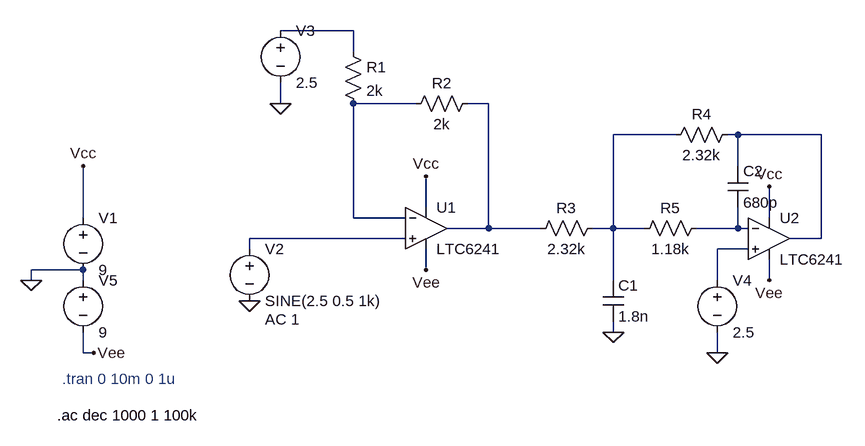
[diagram p0: schematic 60khz bessel lpf.asc]
60khz bessel lpf.asc, the LTspice schematic file:
Version 4
SHEET 1 880 680
WIRE 112 -128 0 -128
WIRE 112 -96 112 -128
WIRE 0 -16 0 -48
WIRE 208 -16 112 -16
WIRE 320 -16 288 -16
WIRE 608 32 512 32
WIRE 704 32 688 32
WIRE 832 32 704 32
WIRE 704 80 704 32
WIRE 224 144 224 96
WIRE -304 160 -304 80
WIRE 112 160 112 -16
WIRE 192 160 112 160
WIRE 752 160 752 112
WIRE 320 176 320 -16
WIRE 320 176 256 176
WIRE 400 176 320 176
WIRE 512 176 512 32
WIRE 512 176 480 176
WIRE 560 176 512 176
WIRE 704 176 704 144
WIRE 704 176 640 176
WIRE 720 176 704 176
WIRE 192 192 -48 192
WIRE 832 192 832 32
WIRE 832 192 784 192
WIRE -48 208 -48 192
WIRE 720 208 672 208
WIRE -304 240 -384 240
WIRE 224 240 224 208
WIRE -384 256 -384 240
WIRE -304 256 -304 240
WIRE 512 256 512 176
WIRE 672 256 672 208
WIRE 752 256 752 224
WIRE 512 336 512 320
WIRE -304 368 -304 336
WIRE -288 368 -304 368
WIRE 672 368 672 336
FLAG -304 80 Vcc
FLAG 224 96 Vcc
FLAG -48 288 0
FLAG 0 -16 0
FLAG 752 112 Vcc
FLAG -384 256 0
FLAG -288 368 Vee
FLAG 224 240 Vee
FLAG 752 256 Vee
FLAG 672 368 0
FLAG 512 336 0
SYMBOL OpAmps\\LTC6241 224 176 R0
SYMATTR InstName U1
SYMBOL voltage -304 144 R0
WINDOW 123 0 0 Left 0
WINDOW 39 0 0 Left 0
SYMATTR InstName V1
SYMATTR Value 9
SYMBOL voltage -48 192 R0
WINDOW 123 24 124 Left 2
WINDOW 39 0 0 Left 0
SYMATTR InstName V2
SYMATTR Value SINE(2.5 0.5 1k)
SYMATTR Value2 AC 1
SYMBOL res 96 -112 R0
SYMATTR InstName R1
SYMATTR Value 2k
SYMBOL res 304 -32 R90
WINDOW 0 0 56 VBottom 2
WINDOW 3 32 56 VTop 2
SYMATTR InstName R2
SYMATTR Value 2k
SYMBOL voltage 0 -144 R0
WINDOW 123 0 0 Left 0
WINDOW 39 0 0 Left 0
SYMATTR InstName V3
SYMATTR Value 2.5
SYMBOL res 496 160 R90
WINDOW 0 0 56 VBottom 2
WINDOW 3 32 56 VTop 2
SYMATTR InstName R3
SYMATTR Value 2.32k
SYMBOL OpAmps\\LTC6241 752 192 R0
SYMATTR InstName U2
SYMBOL voltage -304 240 R0
WINDOW 123 0 0 Left 0
WINDOW 39 0 0 Left 0
SYMATTR InstName V5
SYMATTR Value 9
SYMBOL res 704 16 R90
WINDOW 0 0 56 VBottom 2
WINDOW 3 32 56 VTop 2
SYMATTR InstName R4
SYMATTR Value 2.32k
SYMBOL cap 496 256 R0
SYMATTR InstName C1
SYMATTR Value 1.8n
SYMBOL cap 688 80 R0
SYMATTR InstName C2
SYMATTR Value 680p
SYMBOL res 656 160 R90
WINDOW 0 0 56 VBottom 2
WINDOW 3 32 56 VTop 2
SYMATTR InstName R5
SYMATTR Value 1.18k
SYMBOL voltage 672 240 R0
WINDOW 123 0 0 Left 0
WINDOW 39 0 0 Left 0
SYMATTR InstName V4
SYMATTR Value 2.5
TEXT -336 408 Left 2 ;.tran 0 10m 0 1u
TEXT -344 464 Left 2 !.ac dec 1000 1 100k

The netlist it stands for:
* 60khz bessel lpf.asc
XU1 N007 N002 Vcc Vee N003 LTC6241  ; pins In+ In- V+ V- OUT
V1 Vcc 0 9
V2 N007 0 SINE(2.5 0.5 1k) AC 1
R1 N001 N002 2k
R2 N003 N002 2k
V3 N001 0 2.5
R3 N004 N003 2.32k
XU2 N008 N006 Vcc Vee N005 LTC6241  ; pins In+ In- V+ V- OUT
V5 0 Vee 9
R4 N005 N004 2.32k
C1 N004 0 1.8n
C2 N005 N006 680p
R5 N006 N004 1.18k
V4 N008 0 2.5
* .tran 0 10m 0 1u
.ac dec 1000 1 100k
.lib LTC4.lib
.backanno
.end